# EAGLE design XOrduino-v1 (EAGLE 6.2)
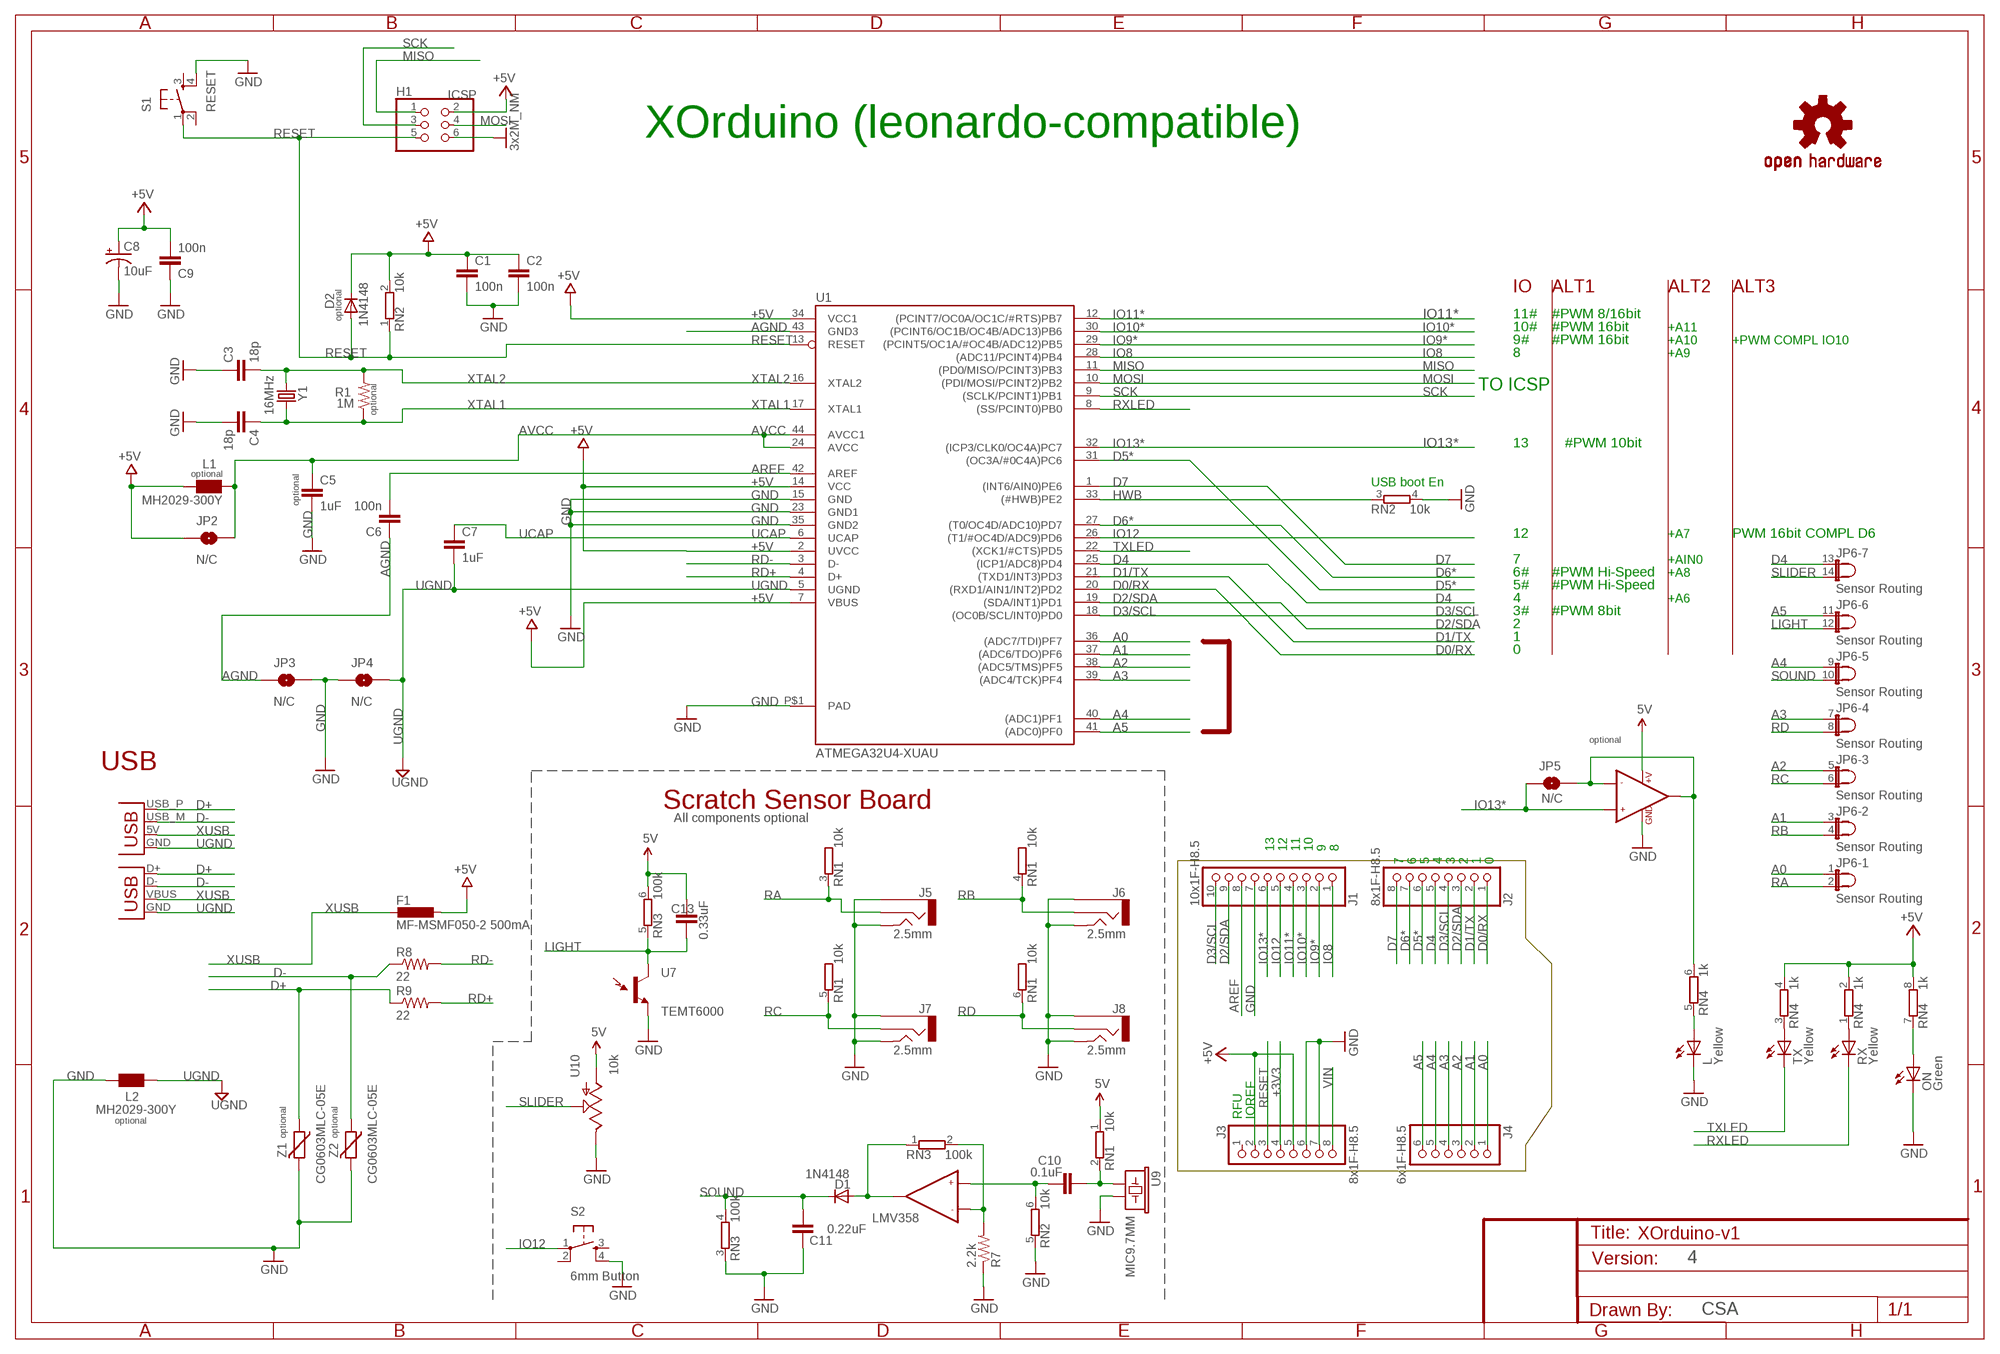
[diagram p0: schematic, sheet 1]

## Parts
C1  100n  CAPPTH  [CAP-PTH-SMALL]
C2  100n  CAPPTH  [CAP-PTH-SMALL]
C3  18p  CAPPTH  [CAP-PTH-SMALL]
C4  18p  CAPPTH  [CAP-PTH-SMALL]
C5  1uF  CAPPTH  [CAP-PTH-SMALL]
C6  100n  CAPPTH  [CAP-PTH-SMALL]
C7  1uF  CAPPTH  [CAP-PTH-SMALL]
C8  10uF  CAP_POLPTH2  [CPOL-RADIAL-10UF-25V]
C9  100n  CAPPTH  [CAP-PTH-SMALL]
C10  0.1uF  CAPPTH  [CAP-PTH-SMALL]
C11  0.22uF  CAPPTH  [CAP-PTH-SMALL]
C13  0.33uF  CAPPTH  [CAP-PTH-SMALL]
D1  1N4148  DIODE1N4148  [DIODE-1N4148]
D2  1N4148  DIODE1N4148  [DIODE-1N4148]
F1  MF-MSMF050-2 500mA  L-EUL1812  [L1812]
H1  ICSP  PINHD-2X3  [2X03]
J1  10x1F-H8.5  PINHD-1X10  [1X10]
J2  8x1F-H8.5  PINHD-1X8  [1X08]
J3  8x1F-H8.5  PINHD-1X8  [1X08]
J4  6x1F-H8.5  PINHD-1X6  [1X06]
J5  2.5mm  AUDIO-JACKSMD  [STEREOJACK2.5MM_SMD]
J6  2.5mm  AUDIO-JACKSMD  [STEREOJACK2.5MM_SMD]
J7  2.5mm  AUDIO-JACKSMD  [STEREOJACK2.5MM_SMD]
J8  2.5mm  AUDIO-JACKSMD  [STEREOJACK2.5MM_SMD]
JP2  N/C  SOLDERJUMPERTRACE  [SJ_2S-TRACE]
JP3  N/C  SOLDERJUMPERTRACE  [SJ_2S-TRACE]
JP4  N/C  SOLDERJUMPERTRACE  [SJ_2S-TRACE]
JP5  N/C  SOLDERJUMPERTRACE  [SJ_2S-TRACE]
JP6  Sensor Routing  JP7QES  [JP7QS]
L  Yellow  LED3MM  [LED3MM]
L1  MH2029-300Y  WE-CBF_0805  [0805]
L2  MH2029-300Y  WE-CBF_0805  [0805]
ON  Green  LED3MM  [LED3MM]
R1  1M  RESISTORAXIAL-0.3  [AXIAL-0.3]
R7  2.2k  RESISTORAXIAL-0.3  [AXIAL-0.3]
R8  22  RESISTORAXIAL-0.3  [AXIAL-0.3]
R9  22  RESISTORAXIAL-0.3  [AXIAL-0.3]
RN1  10k  GE05RP  [SIL6]
RN2  10k  E3RP  [SIL6]
RN3  100k  E3RP  [SIL6]
RN4  1k  E4RP  [SIL8]
RX  Yellow  LED3MM  [LED3MM]
S1  RESET  TAC_SWITCHPTH  [TACTILE-PTH]
S2  6mm Button  TAC_SWITCHPTH  [TACTILE-PTH]
TX  Yellow  LED3MM  [LED3MM]
U1  ATMEGA32U4-XUAU  [TQFP44-PAD]
U7  TEMT6000  [TEMT6000-SEN]
U8  LMV358  [SO08]
U9  MIC9.7MM  [MIC-9.7MM]
U10  10k  POT  [ALPS_POT]
U$5  OSHW-LOGOL  [OSHW-LOGO-L]
X1  USBPCB  [USB-A-PCB]
X2  USB  [USB-MB-H2]
Y1  16MHz  CRYSTALHC49US  [HC49US]
Z1  CG0603MLC-05E  VARISTORCN0603  [CT/CN0603]
Z2  CG0603MLC-05E  VARISTORCN0603  [CT/CN0603]

## Nets
5V: C13.1 RN1.1 RN3.6 U8.8(+V) U10.P$3(A)
+3V3: J3.4
+5V [power]: C1.1 C2.1 C8.1(+) C9.2 D2.C F1.1 H1.2 J3.2 J3.5 JP2.1 L1.1 RN2.2 RN4.2 RN4.4 RN4.8 U1.2(UVCC) U1.7(VBUS) U1.14(VCC) U1.34(VCC1)
A0: J4.1 JP6.1 U1.36((ADC7/TDI)PF7)
A1: J4.2 JP6.3 U1.37((ADC6/TDO)PF6)
A2: J4.3 JP6.5 U1.38((ADC5/TMS)PF5)
A3: J4.4 JP6.7 U1.39((ADC4/TCK)PF4)
A4: J4.5 JP6.9 U1.40((ADC1)PF1)
A5: J4.6 JP6.11 U1.41((ADC0)PF0)
AGND: C6.1 JP3.1 U1.43(GND3)
AREF [aref]: C6.2 J1.8 U1.42(AREF)
AVCC: C5.1 JP2.2 L1.2 U1.24(AVCC) U1.44(AVCC1)
D0/RX: J2.1 U1.20((RXD1/AIN1/INT2)PD2)
D1/TX: J2.2 U1.21((TXD1/INT3)PD3)
D2/SDA: J1.9 J2.3 U1.19((SDA/INT1)PD1)
D3/SCL: J1.10 J2.4 U1.18((OC0B/SCL/INT0)PD0)
D4: J2.5 JP6.13 U1.25((ICP1/ADC8)PD4)
D5*: J2.6 U1.31((OC3A/#0C4A)PC6)
D6*: J2.7 U1.27((T0/OC4D/ADC10)PD7)
D7: J2.8 U1.1((INT6/AIN0)PE6)
D+: R9.P$1 X1.USB_P(D+) X2.D+ Z1.1
D-: R8.P$1 X1.USB_M(D-) X2.D- Z2.1
GND [gnd]: C1.2 C2.2 C3.1 C4.2 C5.2 C8.2(-) C9.1 C11.1 H1.6 J1.7 J3.6 J3.7 J5.1 J5.5 J6.1 J6.5 J7.1 J7.5 J8.1 J8.5 JP3.2 JP4.1 L2.2 L.K(C) ON.K(C) R7.P$1 RN2.4 RN2.5 RN3.3 S1.4 S2.4 U1.15(GND) U1.23(GND1) U1.35(GND2) U1.P$1(PAD) U7.EMITTER(E1) U8.4(GND) U9.2 U10.P$1(E) Z1.2 Z2.2 ; supply symbol labelled 3x2M_NM
HWB: RN2.3 U1.33((#HWB)PE2)
IO8: J1.1 U1.28((ADC11/PCINT4)PB4)
IO9*: J1.2 U1.29((PCINT5/OC1A/#OC4B/ADC12)PB5)
IO10*: J1.3 U1.30((PCINT6/OC1B/OC4B/ADC13)PB6)
IO11*: J1.4 U1.12((PCINT7/OC0A/OC1C/#RTS)PB7)
IO12: J1.5 S2.1 U1.26((T1/#OC4D/ADC9)PD6)
IO13*: J1.6 JP5.1 U1.32((ICP3/CLK0/OC4A)PC7) U8.3(+IN1)
LIGHT: C13.2 JP6.12 RN3.5 U7.COLLECTOR(C1)
MISO: H1.1 U1.11((PD0/MISO/PCINT3)PB3)
MOSI: H1.4 U1.10((PDI/MOSI/PCINT2)PB2)
N$1: RN4.3 TX.A
N$2: L.A RN4.5
N$3: ON.A RN4.7
N$4: RN4.1 RX.A
N$5: R7.P$2 RN3.2 U8.6(-IN2)
N$6: JP5.2 RN4.6 U8.1(OUT1) U8.2(-IN1)
N$9: C10.1 RN1.2 U9.1
N$11: C10.2 RN2.6 U8.5(+IN2)
N$16: D1.A RN3.1 U8.7(OUT2)
RA: J5.4 JP6.2 RN1.3
RB: J6.4 JP6.4 RN1.4
RC: J7.4 JP6.6 RN1.5
RD: J8.4 JP6.8 RN1.6
RD+: R9.P$2 U1.4(D+)
RD-: R8.P$2 U1.3(D-)
RESET: D2.A H1.5 J3.3 RN2.1 S1.1 U1.13(RESET)
RXLED: RX.K(C) U1.8((SS/PCINT0)PB0)
SCK: H1.3 U1.9((SCLK/PCINT1)PB1)
SLIDER: JP6.14 U10.P$2(S)
SOUND: C11.2 D1.C JP6.10 RN3.4
TXLED: TX.K(C) U1.22((XCK1/#CTS)PD5)
UCAP: C7.1 U1.6(UCAP)
UGND [gnd]: C7.2 JP4.2 L2.1 U1.5(UGND) X1.GND X2.GND
VIN [power]: J3.8
XTAL1: C4.1 R1.P$1 U1.17(XTAL1) Y1.2
XTAL2: C3.2 R1.P$2 U1.16(XTAL2) Y1.1
XUSB [usbvcc]: F1.2 X1.5V(VBUS) X2.VBUS
Unconnected: J3.1 S1.2 S1.3 S2.2 S2.3

## Notes on the sheet
- XOrduino (leonardo-compatible)
- IO | ALT1 | ALT2 | ALT3
- optional | 11# | #PWM 8/16bit
- 10# | #PWM 16bit | +A11
- 9# | #PWM 16bit | +A10 | +PWM COMPL IO10
- 8 | +A9
- TO ICSP
- optional
- 13 | #PWM 10bit
- optional
- USB boot En
- optional
- 12 | +A7 | PWM 16bit COMPL D6
- 7 | +AIN0
- 6# | #PWM Hi-Speed | +A8
- 5# | #PWM Hi-Speed
- 4 | +A6
- 3# | #PWM 8bit
- 2
- 1
- 0
- optional
- USB
- Scratch Sensor Board
- All components optional
- 13 | 12 | 11 | 10 | 9 | 8
- 7 | 6 | 5 | 4 | 3 | 2 | 1 | 0
- RFU | IOREF
- optional
- optional | optional
- LMV358
- 4
- CSA

## Library data of the parts
C1-C7 C9-C11 C13 = SparkFun-Passives:CAP: Capacitor Standard 0603 ceramic capacitor, and 0.1" leaded capacitor.
C8 = SparkFun-Passives:CAP_POL: Capacitor Polarized These are standard SMD and PTH capacitors. Normally 10uF, 47uF, and 100uF in electrolytic and tantalum varieties. Always verify the external diameter of the through hole cap, it varies with capacity, voltage, and manufacturer. The EIA devices should be standard.
D1 D2 = SparkFun-DiscreteSemi:DIODE: Diode These are standard reverse protection diodes and small signal diodes. SMA package can handle up to about 1A. SOD-323 can handle about 200mA. What the SOD-323 package when ordering, there are some mfgs out there that are 5-pin packages.
F1 = rcl:L-EU: INDUCTOR, European symbol
H1 = SmartPrj:PINHD-2X3: PIN HEADER
J1 = SmartPrj:PINHD-1X10: PIN HEADER
J2 J3 = SmartPrj:PINHD-1X8: PIN HEADER
J4 = SmartPrj:PINHD-1X6: PIN HEADER
J5-J8 = SparkFun:AUDIO-JACK: 3.5mm Audio Jack Simple 3.5mm common PCB mount audio jack. SKU: PRT-08032
JP2-JP5 = SparkFun-Passives:SOLDERJUMPER: Solder Jumper Standard SMD solder jumper. Used to automate production. Two varients : Normally Open and Normally Closed are the same, but have different paste layers. NC will have a large amount of paste and should jumper during reflow.
JP6 = xorduino:JP7QES: 7x2 block of N/C jumpers
L ON RX TX = led:LED: LED OSRAM: - CHIPLED LG R971, LG N971, LY N971, LG Q971, LY Q971, LO R971, LY R971 LH N974, LH R974 LS Q976, LO Q976, LY Q976 LO Q996 - Hyper CHIPLED LW Q18S LB Q993, LB Q99A, LB R99A - SideLED LS A670, LO A670, LY A670, LG A670, LP A670 LB A673, LV A673, LT A673, LW A673 LH A674 LY A675 LS A676, LA A676, LO A676, LY A676, LW A676 LS A679, LY A679, LG A679 - Hyper Micro SIDELED® LS Y876, LA Y876, LO Y876, LY Y876 LT Y87S - SmartLED LW L88C, LW L88S LB L89C, LB L89S, LG L890 LS L89K, LO L89K, LY L89K LS L896, LA L896, LO L896, LY L896 - TOPLED LS T670, LO T670, LY T670, LG T670, LP T670 LSG T670, LSP T670, LSY T670, LOP T670, LYG T670 LG T671, LOG T671, LSG T671 LB T673, LV T673, LT T673, LW T673 LH T674 LS T676, LA T676, LO T676, LY T676, LB T676, LH T676, LSB T676, LW T676 LB T67C, LV T67C, LT T67C, LS T67K, LO T67K, LY T67K, LW E67C LS E67B, LA E67B, LO E67B, LY E67B, LB E67C, LV E67C, LT E67C LW T67C LS T679, LY T679, LG T679 LS T770, LO T770, LY T770, LG T770, LP T770 LB T773, LV T773, LT T773, LW T773 LH T774 LS E675, LA E675, LY E675, LS T675 LS T776, LA T776, LO T776, LY T776, LB T776 LHGB T686 LT T68C, LB T68C - Hyper Mini TOPLED® LB M676 - Mini TOPLED Santana® LG M470 LS M47K, LO M47K, LY M47K Source: http://www.osram.convergy.de LUXEON: - LUMILED® LXK2-PW12-R00, LXK2-PW12-S00, LXK2-PW14-U00, LXK2-PW14-V00 LXK2-PM12-R00, LXK2-PM12-S00, LXK2-PM14-U00 LXK2-PE12-Q00, LXK2-PE12-R00, LXK2-PE12-S00, LXK2-PE14-T00, LXK2-PE14-U00 LXK2-PB12-K00, LXK2-PB12-L00, LXK2-PB12-M00, LXK2-PB14-N00, LXK2-PB14-P00, LXK2-PB14-Q00 LXK2-PR12-L00, LXK2-PR12-M00, LXK2-PR14-Q00, LXK2-PR14-R00 LXK2-PD12-Q00, LXK2-PD12-R00, LXK2-PD12-S00 LXK2-PH12-R00, LXK2-PH12-S00 LXK2-PL12-P00, LXK2-PL12-Q00, LXK2-PL12-R00 Source: www.luxeon.com KINGBRIGHT: KA-3528ASYC Source: www.kingbright.com
L1 L2 = wuerth-elektronik:WE-CBF: SMD EMI Suppression Ferrite Beads - excellent anti-EMI properties - low DCR - impedances till 3000 ohms - rated current up to 6 A
R1 R7-R9 = SparkFun-Passives:RESISTOR: Resistor Basic schematic elements and footprints for 0603, 1206, and PTH resistors.
RN1 = resistor-sil:GE05RP: SIL RESISTOR; OC_FARNELL: unknown; OC_NEWARK: unknown
RN2 RN3 = resistor-sil:E3RP: SIL RESISTOR; OC_FARNELL: unknown; OC_NEWARK: unknown
RN4 = resistor-sil:E4RP: SIL RESISTOR; OC_FARNELL: unknown; OC_NEWARK: unknown
S1 S2 = SparkFun-Electromechanical:TAC_SWITCH: Momentary Switch Button commonly used for reset or general input. Spark Fun Electronics SKU : COM-00097
U1 = SmartPrj:ATMEGA32U4-XU
U7 = SparkFun:TEMT6000: Ambient Light Sensor Simple light detection sensor. Output varies with light intensity input. Spark Fun Electronics SKU : COM-08348
U8 = SparkFun:LMV358
U9 = SparkFun:MIC: Microphone Omni-directional electret microphone. 9.7mm standard diameter.
U10 = SparkFun-Electromechanical:POT
U$5 = SparkFun-Aesthetics:OSHW-LOGO: Open Source Hardware Logo This logo indicates the piece of hardware it is found on incorporates a OSHW license and/or adheres to the definition of open source hardware found here: http://freedomdefined.org/OSHW
X1 = SparkFun-Connectors:USB: USB Connectors USB-B-PTH is fully proven SKU : PRT-00139 USB-miniB is fully proven SKU : PRT-00587 USB-A-PCB is untested. USB-A-H is throughly reviewed, but untested. Spark Fun Electronics SKU : PRT-00437 USB-B-SMT is throughly reviewed, but untested. Needs silkscreen touching up. USB-A-S has not been used/tested USB-MB-H has not been used/tested
X2 = xorduino:USB
Y1 = SparkFun-FreqCtrl:CRYSTAL: Various standard crystals. Proven footprints. Spark Fun Electronics SKU : COM-00534
Z1 Z2 = varistor:VARISTOR: VARISTOR

## Net classes
0 default: width 0.254 mm, drill 0.61 mm, clearance 0.254 mm
1 power: width 0.254 mm, drill 0.61 mm, clearance 0.254 mm
2 gnd: width 0.254 mm, drill 0.61 mm, clearance 0.254 mm
3 usbvcc: width 0.254 mm, drill 0.61 mm, clearance 0.254 mm
4 aref: width 0.254 mm, drill 0.61 mm, clearance 0.254 mm

## Board
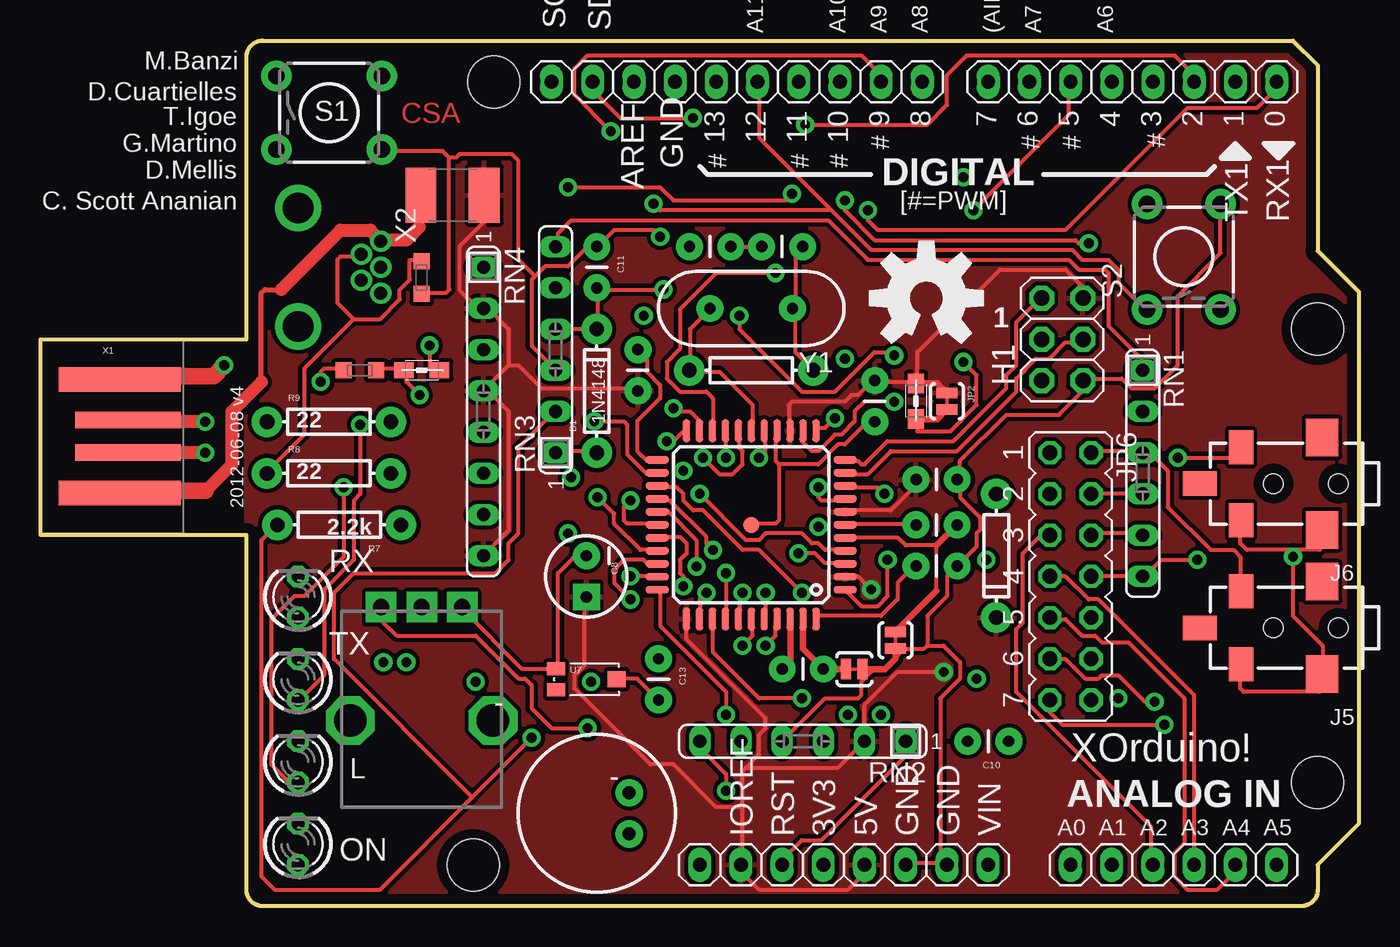
[diagram p1: board, top side]
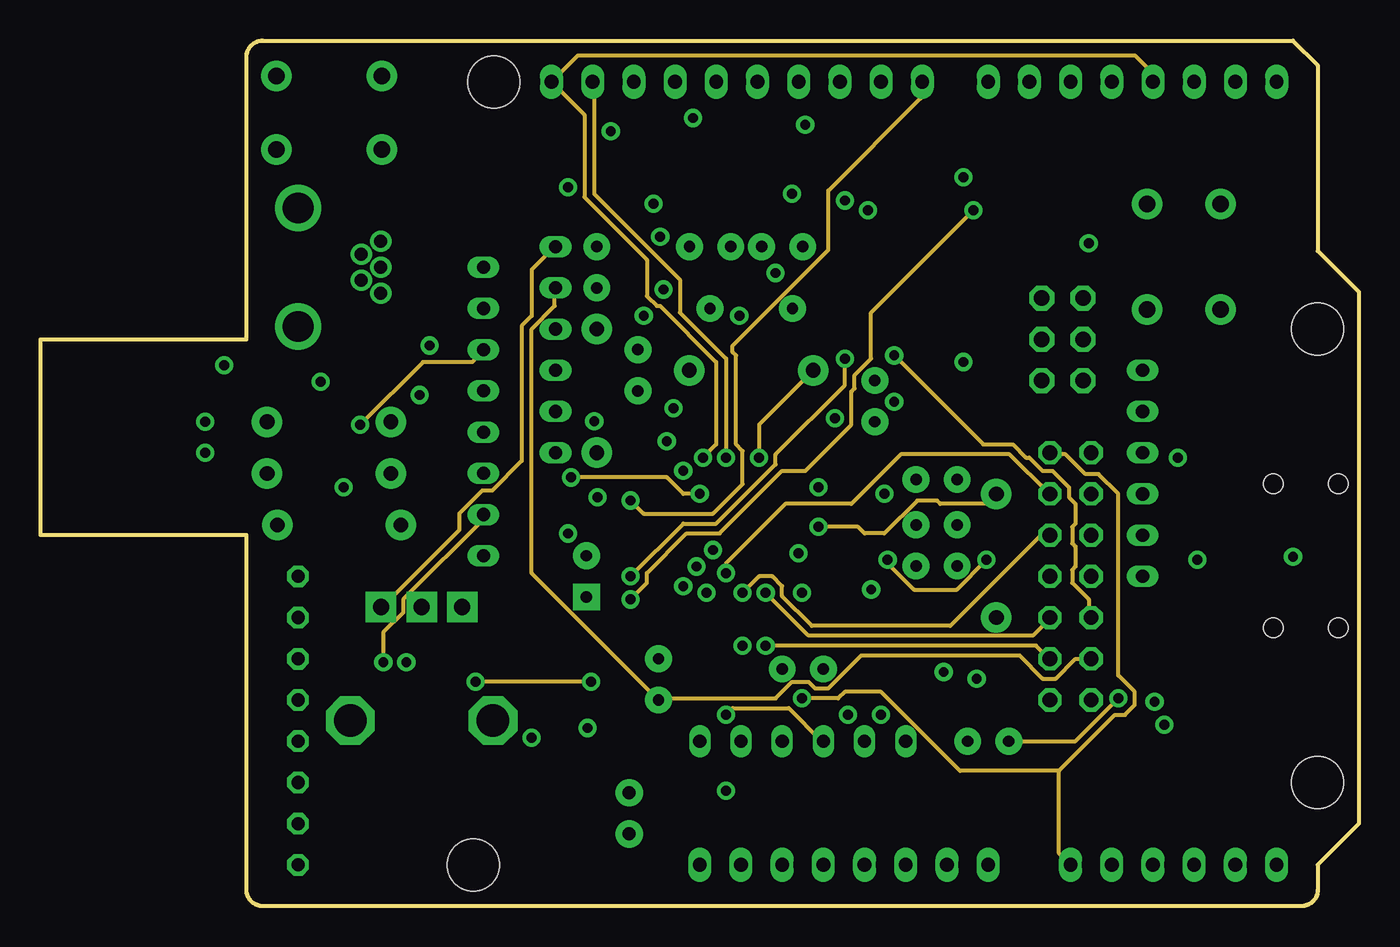
[diagram p2: board, inner layer Route2]
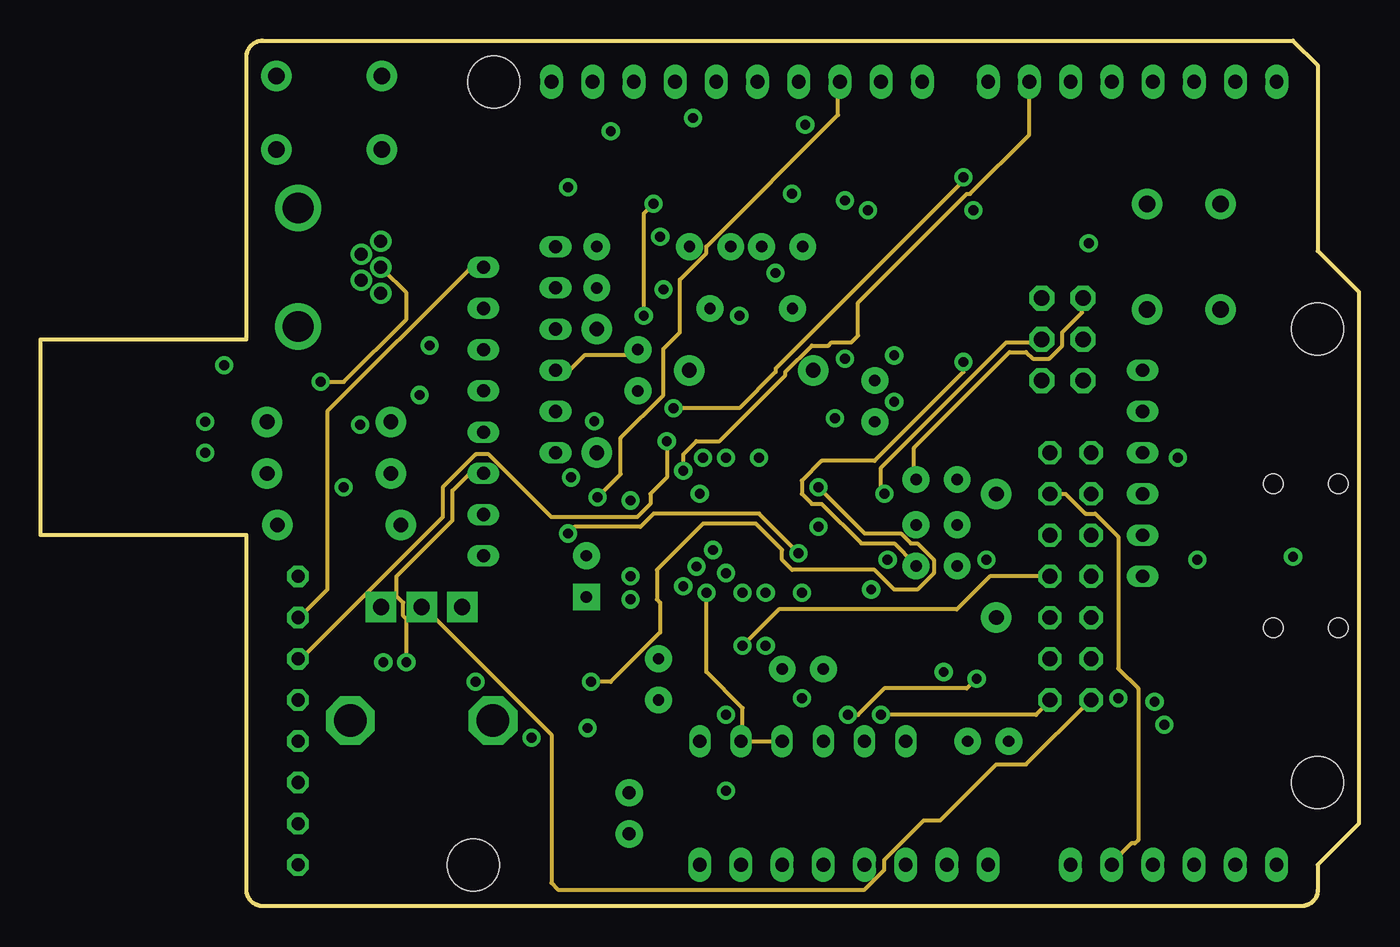
[diagram p3: board, inner layer Route15]
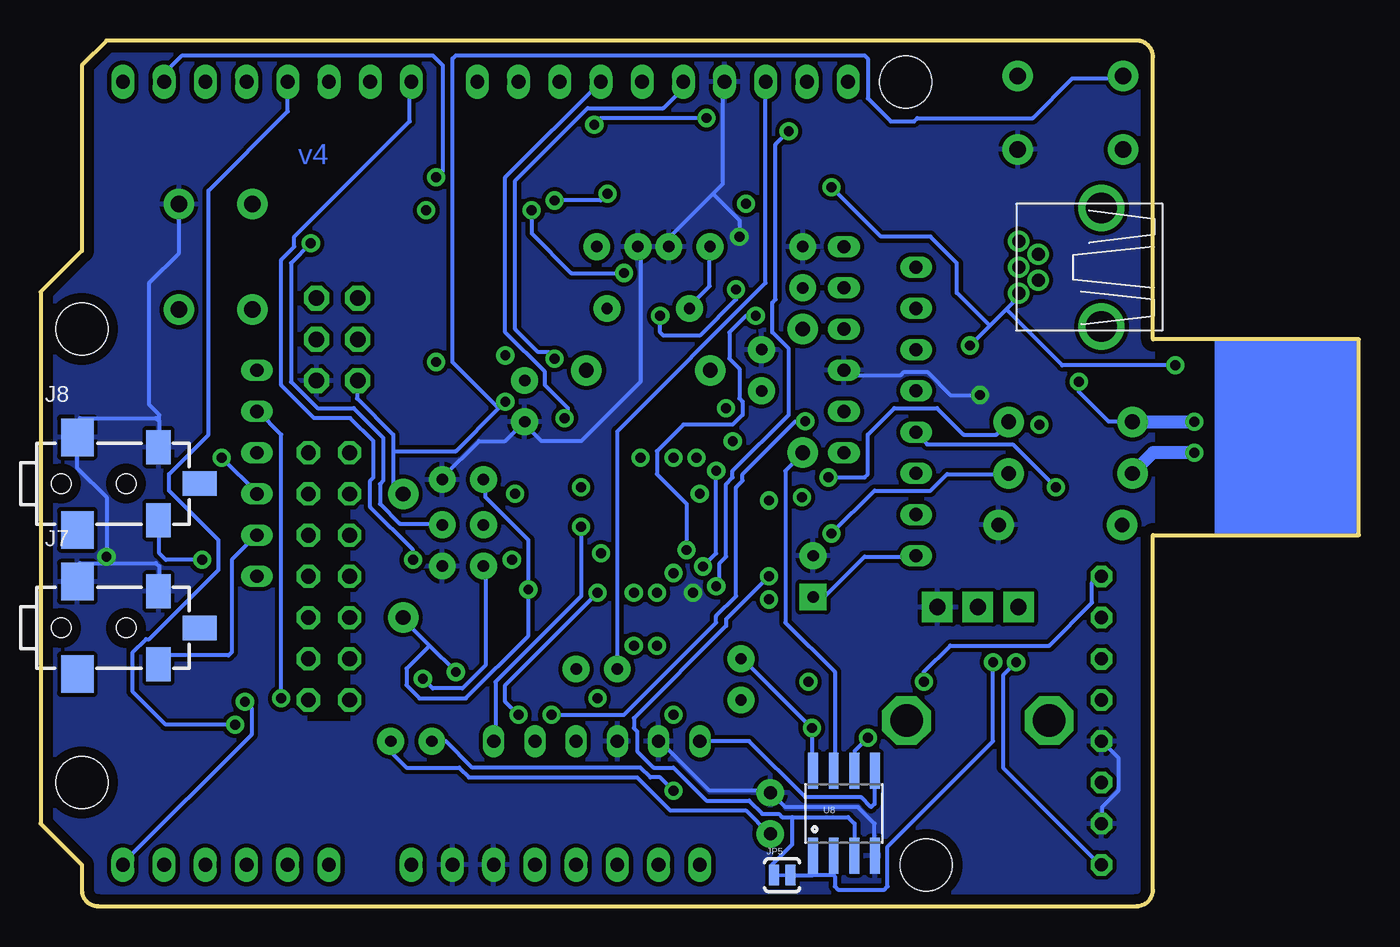
[diagram p4: board, bottom side, seen from below]

Size 81.28 x 53.34 mm. Coordinates in mm from the lower left corner, seen from the top.
Outline: 77.22,53.34 78.74,51.82 78.74,40.39 81.28,37.85 81.28,5.08 78.74,2.54 78.74,1 arc-90 77.74,0 13.7,0 arc-90 12.7,1 12.7,22.86 0,22.86 0,34.92 12.7,34.92 12.7,52.34 arc-90 13.7,53.34 77.22,53.34
Copper layers (1*2+15*16): Top 0.035mm / dielectric 0.2mm / Route2 0.035mm / dielectric 0.26mm / Route15 0.035mm / dielectric 0.2mm / Bottom 0.035mm
Design rules: minimum track width 8mil, minimum drill 22mil, track to track 8mil, track to pad 8mil, pad to pad 8mil, via to via 12mil, smd to smd 8mil, copper to edge 24mil, drill to drill 12mil, minimum pad ring 10mil, minimum via ring 10mil, stop-mask expansion 2mil, vias tented up to drill 30mil, thermal gap 10mil
Holes 3.2 mm at 78.74,35.56 78.74,7.62 27.94,50.8 26.67,2.54
vRestrict: area 42.5,38.6 to 43.1,38.9; area 35.8,35.2 to 36.4,35.7; area 44.5,35.2 to 45.2,35.7; area 41.3,35.2 to 41.8,35.7; area 47.9,10.3 to 48.5,10.8; area 50.4,10.2 to 50.9,11

### Footprints (pad centres in the part's own frame; a part is rotated, then mirrored left to right if it is on the bottom)
CAP-PTH-SMALL = drill 0.7 pad 1.651: 1 0,0; 2 2.54,0
CPOL-RADIAL-10UF-25V = drill 0.7 pad 1.651 square: 1 1.27,0 | drill 0.7 pad 1.651: 2 -1.27,0
DIODE-1N4148 = drill 0.9 pad 1.88: A -3.81,0; C 3.81,0
L1812 = smd 1.9 x 3.4: 1 -1.95,0; 2 1.95,0
2X03 = drill 0.95 pad 1.55 octagon: 1 -2.54,-1.27; 2 -2.54,1.27; 3 0,-1.27; 4 0,1.27; 5 2.54,-1.27; 6 2.54,1.27
1X10 = drill 0.85 pad 1.422 long: 1 -11.43,0; 2 -8.89,0; 3 -6.35,0; 4 -3.81,0; 5 -1.27,0; 6 1.27,0; 7 3.81,0; 8 6.35,0; 9 8.89,0; 10 11.43,0
1X08 = drill 0.85 pad 1.422 long: 1 -8.89,0; 2 -6.35,0; 3 -3.81,0; 4 -1.27,0; 5 1.27,0; 6 3.81,0; 7 6.35,0; 8 8.89,0
1X06 = drill 0.85 pad 1.422 long: 1 -6.35,0; 2 -3.81,0; 3 -1.27,0; 4 1.27,0; 5 3.81,0; 6 6.35,0
STEREOJACK2.5MM_SMD = smd 1.5 x 2.1: 1 6,2.25; 4 6,-2.25 | smd 2.1 x 1.5: 3 8.55,0 | smd 2 x 2.3: 5 1,2.85; A 1,-2.85 | hole 1.2: 0,0; 4,0
SJ_2S-TRACE = smd 0.635 x 1.27: 1 -0.508,0; 2 0.508,0
JP7QS = drill 0.914 octagon: 1 -7.62,-1.27; 2 -7.62,1.27; 3 -5.08,-1.27; 4 -5.08,1.27; 5 -2.54,-1.27; 6 -2.54,1.27; 7 0,-1.27; 8 0,1.27; 9 2.54,-1.27; 10 2.54,1.27; 11 5.08,-1.27; 12 5.08,1.27; 13 7.62,-1.27; 14 7.62,1.27
LED3MM = drill 0.813 octagon: A -1.27,0; K 1.27,0
0805 = smd 1.2 x 1: 1 -1.1,0; 2 1.1,0
AXIAL-0.3 = drill 0.9 pad 1.88: P$1 -3.81,0; P$2 3.81,0
SIL6 = drill 0.813 long: 1 -6.35,0; 2 -3.81,0; 3 -1.27,0; 4 1.27,0; 5 3.81,0; 6 6.35,0
SIL8 = drill 0.813 long: 1 -8.89,0; 2 -6.35,0; 3 -3.81,0; 4 -1.27,0; 5 1.27,0; 6 3.81,0; 7 6.35,0; 8 8.89,0
TACTILE-PTH = drill 1.016 pad 1.88: 1 -3.251,2.261; 2 3.251,2.261; 3 -3.251,-2.261; 4 3.251,-2.261
TQFP44-PAD = smd 1.4 x 0.45: 1 -5.8,4; 2 -5.8,3.2; 3 -5.8,2.4; 4 -5.8,1.6; 5 -5.8,0.8; 6 -5.8,0; 7 -5.8,-0.8; 8 -5.8,-1.6; 9 -5.8,-2.4; 10 -5.8,-3.2; 11 -5.8,-4; 23 5.8,-4; 24 5.8,-3.2; 25 5.8,-2.4; 26 5.8,-1.6; 27 5.8,-0.8; 28 5.8,0; 29 5.8,0.8; 30 5.8,1.6; 31 5.8,2.4; 32 5.8,3.2; 33 5.8,4 | smd 0.45 x 1.4: 12 -4,-5.8; 13 -3.2,-5.8; 14 -2.4,-5.8; 15 -1.6,-5.8; 16 -0.8,-5.8; 17 0,-5.8; 18 0.8,-5.8; 19 1.6,-5.8; 20 2.4,-5.8; 21 3.2,-5.8; 22 4,-5.8; 34 4,5.8; 35 3.2,5.8; 36 2.4,5.8; 37 1.6,5.8; 38 0.8,5.8; 39 0,5.8; 40 -0.8,5.8; 41 -1.6,5.8; 42 -2.4,5.8; 43 -3.2,5.8; 44 -4,5.8 | smd 1 x 1: P$1 0,0
TEMT6000-SEN = smd 1.1 x 0.8: BASE -1.87,-0.65; EMITTER -1.87,0.65 | smd 1.1 x 1: COLLECTOR 1.86,0.01
SO08 = smd 0.61 x 2.21: 1 -1.905,-2.616; 2 -0.635,-2.616; 3 0.635,-2.616; 4 1.905,-2.616; 5 1.905,2.616; 6 0.635,2.616; 7 -0.635,2.616; 8 -1.905,2.616
MIC-9.7MM = drill 0.8 pad 1.676: 1 -2,1.27; 2 -2,-1.27
ALPS_POT = drill 1 pad 1.88 square: P$1 7,-2.5; P$2 7,0; P$3 7,2.5 | drill 2 octagon: P$4 0,-4.4; P$5 0,4.4
USB-A-PCB = smd 7.5 x 1.5: 5V -0.2,-3.5; GND -0.2,3.5 | smd 6.5 x 1: USB_M 0.3,-1; USB_P 0.3,1
USB-MB-H2 = drill 0.8 pad 1.219: D+ 5.1,0; D- 3.9,0.8; GND 5.1,-1.6; ID 3.9,-0.8; VBUS 5.1,1.6 | drill 1.9 pad 2.667: P$6 0,-3.65; P$7 0,3.65
HC49US = drill 0.7 pad 1.651: 1 -2.54,0; 2 2.54,0
CT/CN0603 = smd 1 x 1: 1 -1,0; 2 1,0

### Placement (x,y rotation side)
C1  36.83,31.75 90 top
C2  51.44,32.38 270 top
C3  44.45,40.64 0 top
C4  40.01,40.64 0 top
C5  53.98,20.95 0 top
C6  48.26,14.61 180 top
C7  53.98,23.5 0 top
C8  33.66,20.32 270 top
C9  56.52,26.29 180 top
C10  59.69,10.16 180 top
C11  34.29,40.64 270 top
C13  38.1,15.24 270 top
D1  34.29,31.75 90 top
D2  58.93,21.59 270 top
F1  25.4,43.81 180 top
H1  62.99,34.92 270 top
J1  42.93,50.8 180 top
J2  67.31,50.8 180 top
J3  49.53,2.54 0 top
J4  69.85,2.54 0 top
J5  80.01,17.14 180 top
J6  80.01,26.04 180 top
J7  80.01,17.14 0 bottom
J8  80.01,26.04 0 bottom
JP2  55.88,31.11 270 top
JP3  50.16,14.61 0 top
JP4  52.7,16.38 90 top
JP5  35.56,1.91 0 bottom
JP6  63.5,20.32 270 top
L  15.88,8.89 90 top
L1  53.98,31.11 270 top
L2  23.5,33.02 180 top
ON  15.88,3.81 90 top
R1  43.81,33.02 0 top
R7  18.41,23.5 180 top
R8  17.78,26.67 0 top
R9  17.78,29.84 0 top
RN1  67.94,26.67 270 top
RN2  46.99,10.16 180 top
RN3  31.75,34.29 90 top
RN4  27.3,30.48 270 top
RX  15.88,19.05 90 top
S1  17.78,48.9 0 top
S2  70.48,40.01 90 top
TX  15.88,13.97 90 top
U1  43.81,23.5 180 top
U7  33.66,13.97 0 top
U8  31.75,5.71 0 bottom
U9  34.29,5.71 180 top
U10  23.5,11.43 90 top
U$5  54.61,37.47 0 top
X1  5.08,28.96 0 top
X2  15.88,39.37 0 top
Y1  43.81,36.83 180 top
Z1  19.68,33.02 0 top
Z2  23.5,38.73 270 top

### Tracks (layer width: path | path; a pad name or v marks a point on that pad's centre or on a via)
5V  (via drill 0.61)
  Top 0.254: RN1.1 67.87,33.12 67.87,33.73 65.84,35.76 65.84,39.01 65.63,39.22 64.01,39.22 63.4,39.83 51,39.83 48.56,42.27 32.72,42.27 31.9,41.45 31.9,40.64 RN3.6 | v33.73,10.97 31.5,10.97 30.28,12.19 30.28,13.61 29.87,14.02 29.46,14.02 26.82,16.66 21.95,16.66 21.13,17.48 21.13,18.29 U10.P$3
  Route2 0.254: U10.P$3 21.13,18.49 25.81,23.16 25.81,24.18 27.23,25.6 27.84,25.6 29.67,27.43 29.67,35.76 30.28,36.37 30.28,39.22 31.7,40.64 RN3.6
  Bottom 0.254: U8.8 33.73,8.33 v33.73,10.97 38,15.24 C13.1
+5V  (via drill 0.61)
  Top 0.254: F1.1 27.43,43.69 27.43,42.27 25.81,40.64 25.81,38 26.82,36.98 27.23,36.98 RN4.2 27.43,36.98 28.85,35.56 28.85,33.33 | 28.85,33.33 27.43,31.9 | 28.85,33.33 29.46,33.33 30.89,31.9 36.78,31.9 C1.1 | 27.43,31.9 28.85,30.48 28.85,23.16 27.43,21.74 RN4.8 | 27.43,31.9 RN4.4 | U1.14 46.13,29.46 46.13,30.89 46.33,31.09 49.58,31.09 49.99,31.5 50.39,31.5 51.41,32.51 C2.1 51.61,32.31 53.85,32.31 L1.1 54.05,32.31 54.05,34.14 59.13,39.22 63.2,39.22 64.21,38.2 64.21,37.59 H1.2 | 43.48,8.53 43.28,8.33 43.28,6.1 | 43.48,8.53 44.3,9.35 44.3,10.57 44.7,10.97 44.7,11.58 39.83,16.46 39.83,17.68 U1.34 | 43.28,6.1 43.28,2.64 J3.2 43.28,2.44 43.28,2.03 44.3,1.02 49.78,1.02 50.8,2.03 J3.5 | 43.48,8.53 49.17,8.53 RN2.2 50.8,12.39 52.83,14.43 v55.68,14.43 | 43.28,6.1 41.66,6.1 39.01,8.74 37.59,8.74 32.92,13.41 32.92,14.22 33.53,14.83 33.53,18.9 C8.1 | v51.21,19.51 50.39,20.32 49.78,20.32 U1.2 | U1.7 49.78,24.38 52.43,24.38 53.85,25.81 53.85,26.21 C9.2
  Top 0.406: L1.1 55.29,32.22 JP2.1
  Route15 0.254: H1.2 64.21,37.39 64.21,36.58 62.99,35.36 62.99,34.54 62.18,33.73 61.16,33.73 60.76,34.14 59.74,34.14 53.85,28.25 53.85,26.42 C9.2
  Bottom 0.254: RN4.8 27.43,21.54 30.48,21.54 32.92,19.1 33.53,19.1 C8.1 | v55.68,14.43 57.3,16.05 | 57.3,16.05 58.93,17.68 D2.C | 57.3,16.05 58.73,14.63 58.73,13.61 57.91,12.8 55.07,12.8 51.21,16.66 v51.21,19.51 51.21,22.55 53.85,25.2 53.85,26.21 C9.2
  pour Top (isolate 0.001): 12.7,1.27 12.7,52.07 13.97,53.34 77.47,53.34 78.74,52.07 78.74,40.64 81.28,38.1 81.28,5.08 78.74,2.54 78.74,1.27 77.47,0 13.97,0
A0  (via drill 0.61)
  Top 0.254: v46.94,12.8 44.3,12.8 41.45,15.65 41.45,17.68 U1.36
  Route2 0.254: 62.79,8.33 66.24,11.79 66.85,11.79 67.46,12.39 67.46,13.21 66.45,14.22 66.45,25.4 65.23,26.62 64.41,26.62 63.2,27.84 62.38,27.84 JP6.1 | 62.79,8.33 62.79,3.25 J4.1 | v46.94,12.8 49.17,12.8 49.58,13.21 51.82,13.21 56.69,8.33 62.79,8.33
A1  (via drill 0.61)
  Top 0.254: v42.27,20.52 42.27,17.88 U1.37
  Route2 0.254: v42.27,20.52 42.27,21.13 45.92,24.79 49.99,24.79 53.03,27.84 59.74,27.84 62.18,25.4 JP6.3
  Route15 0.254: JP6.3 63.2,25.4 64.41,24.18 65.02,24.18 66.45,22.76 66.45,14.63 67.67,13.41 67.67,4.06 67.46,3.86 67.26,3.86 66.04,2.64 J4.2
A2  (via drill 0.61)
  Top 0.254: JP6.5 62.18,22.76 61.57,22.76 60.55,21.74 60.55,17.48 60.15,17.07 60.15,13.21 68.48,4.88 68.48,2.64 J4.3 | v43.28,19.3 43.08,19.1 43.08,17.88 U1.38
  Route2 0.254: v43.28,19.3 44.3,20.32 45.11,20.32 45.72,19.71 45.72,19.1 47.55,17.27 56.08,17.27 61.57,22.76 62.18,22.76 JP6.5
A3  (via drill 0.61)
  Top 0.254: JP6.7 63.2,20.32 64.62,18.9 65.23,18.9 71.12,13.01 J4.4 | v43.28,16.05 43.89,16.66 43.89,17.68 U1.39
  Route15 0.254: v43.28,16.05 45.52,18.29 56.49,18.29 58.52,20.32 JP6.7
A4  (via drill 0.61)
  Top 0.254: v44.7,19.3 44.7,17.88 U1.40 | J4.5 73.56,2.44 73.56,2.03 72.54,1.02 70.71,1.02 69.9,1.83 69.9,3.25 70.51,3.86 70.51,12.8 67.06,16.26 65.43,16.26 65.02,16.66 64.21,16.66 63.2,17.68 62.38,17.68 JP6.9
  Route2 0.254: v44.7,19.3 47.35,16.66 61.16,16.66 62.18,17.68 JP6.9
A5  (via drill 0.61)
  Top 0.254: v44.7,16.05 45.31,16.66 45.31,17.68 U1.41 | v68.68,12.6 68.07,12.6 66.45,14.22 65.43,14.22 65.23,14.02 64.41,14.02 63.2,15.24 JP6.11
  Route2 0.254: v44.7,16.05 61.37,16.05 62.18,15.24 JP6.11
  Bottom 0.254: v68.68,12.6 68.28,12.19 68.28,10.57 76.2,2.64 J4.6
AGND
  Top 0.406: JP3.1 C6.1 47.02,15.85 U1.43
AREF
  Top 0.406: U1.42 46.23,17.68 46.23,14.61 C6.2
  Bottom 0.254: J1.8 36.58,38.41 45.72,29.26 C6.2
AVCC  (via drill 0.61)
  Top 0.254: v56.9,33.53 57.71,32.72 57.71,30.89 56.08,29.26 54.05,29.26 54.05,29.87 L1.2 | v34.14,29.87 35.97,29.87 36.17,29.67 36.17,27.84 37.39,26.62 38,26.62 U1.24 | U1.44 47.95,17.88 51.82,17.88 52.83,18.9 52.83,19.91 53.85,20.93 C5.1
  Top 0.406: L1.2 55.29,30.02 JP2.2
  Route15 0.254: v56.9,33.53 56.9,32.92 51.41,27.43 48.16,27.43 46.94,26.21 46.94,25.4 47.55,24.79 48.16,24.79 50.6,22.35 52.63,22.35 53.85,21.13 C5.1 | v49.78,11.79 50.39,11.79 52.02,13.41 57.1,13.41 v57.71,14.02
  Bottom 0.254: v34.14,29.87 34.75,29.87 38,26.62 38,26.21 38.41,25.81 38.41,19.1 39.62,17.88 39.62,17.48 45.31,11.79 v49.78,11.79 | v57.71,14.02 57.1,13.41 55.27,13.41 53.85,14.83 53.85,20.93 C5.1
D0/RX  (via drill 0.61)
  Top 0.254: v45.31,39.01 41.66,39.01 39.42,36.78 39.42,34.34 38.61,33.53 38.61,32.51 39.42,31.7 41.05,31.7 41.45,31.29 41.45,29.46 U1.20 | v51,42.88 51,42.27 51.61,41.66 63.2,41.66 70.71,49.17 74.98,49.17 76.2,50.39 J2.1
  Bottom 0.254: v45.31,39.01 48.56,39.01 51,41.45 v51,42.88
D1/TX  (via drill 0.61)
  Top 0.254: v39.01,30.68 39.22,30.48 40.03,30.48 40.64,29.87 40.64,29.46 U1.21
  Route15 0.254: v39.01,30.68 43.08,30.68 45.31,32.92 45.31,33.12 56.9,44.7 v56.9,44.91
  Bottom 0.254: v56.9,44.91 56.49,45.31 56.49,51.82 57.1,52.43 72.54,52.43 73.56,51.41 73.56,50.8 J2.2
D2/SDA  (via drill 0.61)
  Top 0.254: v42.27,27.64 42.27,29.26 U1.19 | J2.3 71.12,51.21 69.9,52.43 57.1,52.43 55.88,51.21 55.88,49.38 54.66,48.16 v47.14,48.16 | v40.23,48.56 35.76,48.56 34.14,50.19 34.14,50.8 J1.9
  Route2 0.254: v42.27,27.64 42.27,33.73 39.42,36.58 39.42,38.61 34.14,43.89 34.14,50.8 J1.9
  Bottom 0.254: v47.14,48.16 46.74,48.56 v40.23,48.56
D3/SCL  (via drill 0.61)
  Top 0.254: v40.84,27.64 41.86,26.62 42.67,26.62 43.28,27.23 43.28,28.04 43.08,28.25 43.08,29.26 U1.18
  Route2 0.254: v40.84,27.64 41.66,28.45 41.66,33.53 38.2,36.98 38,36.98 37.39,37.59 37.39,39.83 33.53,43.69 33.53,48.77 J1.10 33.12,52.43 67.46,52.43 68.48,51.41 68.48,50.8 J2.4
D4  (via drill 0.61)
  Top 0.254: v69.29,11.18 62.99,11.18 62.18,11.99 62.18,12.6 JP6.13 | v46.94,19.3 44.3,21.95 43.28,21.95 40.84,24.38 40.23,24.38 39.62,24.99 39.62,25.4 39.22,25.81 38.2,25.81 U1.25
  Route15 0.254: v51.82,11.79 61.37,11.79 62.18,12.6 JP6.13
  Bottom 0.254: J2.5 66.04,48.97 70.92,44.09 70.92,29.06 73.36,26.62 73.36,25.6 70.31,22.55 70.31,20.73 74.57,16.46 74.78,16.46 75.59,15.65 75.59,13.21 73.56,11.18 v69.29,11.18 | v46.94,19.3 52.63,13.61 52.63,12.6 v51.82,11.79
D5*  (via drill 0.61)
  Top 0.254: v57.51,42.88 63.4,48.77 63.4,50.8 J2.6 | v36.37,18.9 35.36,19.91 35.36,20.73 35.97,21.34 37.19,21.34 37.39,21.13 38,21.13 U1.31
  Route2 0.254: v57.51,42.88 51.21,36.58 51.21,33.73 50.19,32.72 50.19,31.9 49.99,31.7 49.99,29.67 47.14,26.82 45.72,26.82 41.86,22.96 39.83,22.96 37.39,20.52 37.39,19.91 v36.37,18.9
D6*  (via drill 0.61)
  Top 0.254: v40.44,20.93 40.44,22.55 38.61,24.38 38.2,24.38 U1.27
  Route15 0.254: J2.7 60.96,47.55 57.3,43.89 57.1,43.89 50.39,37.19 50.39,35.15 49.99,34.75 48.77,34.75 48.56,34.54 47.55,34.54 45.92,32.92 45.92,32.72 41.86,28.65 40.44,28.65 39.62,27.84 v39.62,26.82
  Bottom 0.254: v39.62,26.82 39.62,21.74 v40.44,20.93
D7  (via drill 0.61)
  Top 0.254: v52.22,21.34 52.22,19.1 51.61,18.49 50.6,18.49 49.78,19.3 U1.1
  Route2 0.254: v58.32,21.34 56.49,19.51 53.85,19.51 52.22,21.13 v52.22,21.34
  Bottom 0.254: v58.32,21.34 58.32,21.95 60.96,24.59 60.96,26.21 60.76,26.42 60.76,28.65 62.18,30.07 64.41,30.07 66.45,32.11 66.45,39.83 65.63,40.64 65.63,41.25 58.52,48.36 58.52,50.8 J2.8
D+  (via drill 0.61)
  Top 0.254: v17.27,32.31 17.27,32.92 17.48,33.12 18.49,33.12 Z1.1 | 5.49,29.84 X1.USB_P
  Top 0.813: v10.16,29.84 5.49,29.84
  Route15 0.254: v17.27,32.31 18.69,32.31 22.55,36.17 22.55,37.8 21.13,39.22 X2.D+
  Bottom 0.254: v17.27,32.31 17.27,31.7 15.44,29.87 14.02,29.87 R9.P$1
  Bottom 0.813: R9.P$1 v10.16,29.84
D-  (via drill 0.61)
  Top 0.254: 19.3,36.17 20.93,36.17 22.15,37.39 22.15,38 22.76,38.61 22.76,39.83 23.37,39.83 Z2.1 | 19.3,36.17 18.29,37.19 18.29,39.83 18.49,40.03 19.71,40.03 X2.D- | 19.3,36.17 16.26,33.12 16.26,29.06 14.02,26.82 R8.P$1 | 10.16,27.96 v10.16,27.94
  Top 0.813: X1.USB_M 10.16,27.96
  Bottom 0.813: v10.16,27.94 12.7,27.94 R8.P$1
GND  (via drill 0.61)
  Top 0.254: 55.47,2.64 55.88,2.64 J3.7 55.47,2.64 | 55.47,2.64 53.44,2.64 J3.6 | RN2.4 48.36,12.8 50.39,12.8 50.6,13.01 50.6,13.82 51.21,14.43 51.21,14.61 | 55.47,2.64 55.47,12.8 56.69,14.02 56.69,15.04 55.68,16.05 54.66,16.05 | 54.66,16.05 54.46,15.85 53.24,15.85 52.83,15.44 52.7,15.44 | v41.05,19.3 40.64,18.9 40.64,17.88 U1.35 | U10.P$1 26.01,18.29 29.67,14.63 31.7,14.63 U7.EMITTER 31.9,14.43 32.11,14.63 31.9,14.83 31.9,20.52 32.92,21.54 33.53,21.54 C8.2 | Z1.2 20.73,33.12 22.35,33.12 L2.2 22.55,32.92 22.55,32.31 v23.37,31.5 | 25.2,46.13 24.79,46.53 21.13,46.53 S1.4 | 25.2,46.13 25.2,38 24.99,37.8 23.57,37.8 Z2.2 | J5.1 73.97,14.83 73.97,13.41 74.17,13.21 78.84,13.21 79.05,13.41 79.05,14.22 J5.5 79.05,14.43 79.05,16.05 77.22,17.88 v77.22,21.54 77.22,21.95 | 77.22,21.95 78.84,21.95 79.05,22.15 79.05,23.16 J6.5 | 77.22,21.95 74.37,21.95 73.97,22.35 73.97,23.77 J6.1 | 45.52,27.23 45.52,23.77 45.31,23.57 43.89,23.57 U1.P$1 | 45.52,27.23 45.31,27.43 45.31,29.26 U1.15 | 45.52,27.23 47.95,27.23 49.17,28.45 49.58,28.45 50.8,29.67 51.41,29.67 C2.2 | C1.2 37.39,33.73 37.39,32.92 38.2,32.11 38.2,31.29 36.78,29.87 36.78,28.04 37.39,27.43 38,27.43 U1.23 | v38.2,41.25 37.8,41.66 35.36,41.66 34.34,40.64 C11.1 33.73,40.64 32.51,39.42 31.09,39.42 30.48,38.81 | C4.2 C3.1 | 30.48,38.81 30.28,38.61 30.28,34.54 31.7,33.12 RN3.3 | S2.4 72.75,40.23 70.1,37.59 70.1,33.33 68.68,31.9 67.26,31.9 66.65,32.51 64.41,32.51 H1.6 64.21,32.31 64.21,31.7 62.79,30.28 59.54,30.28 56.69,27.43 56.69,26.42 C9.1 56.69,26.21 56.69,25.2 57.91,23.98 57.91,23.16 57.71,22.96 57.71,22.15 C5.2 55.88,20.32 55.88,19.1 54.66,17.88 54.66,16.05
  Top 0.254: 25.2,46.13 25.6,46.13 25.81,46.33 29.06,46.33 29.46,45.92 29.46,39.83 30.48,38.81
  Top 0.406: JP4.1 52.7,15.44 52.7,15.24 52.07,14.61 51.21,14.61 JP3.2
  Route15 0.254: v41.05,19.3 41.05,14.43 43.28,12.19 43.28,10.16 | 43.28,10.16 RN2.4 | 43.28,10.16 RN2.5 | RN3.3 31.9,33.12 32.72,33.12 33.53,33.93 36.58,33.93 36.78,34.14 C1.2
  Bottom 0.254: ON.K 15.85,5.08 15.85,6.1 14.83,7.11 14.83,9.14 15.85,10.16 L.K | 29.87,3.05 U8.4 29.87,3.25 29.87,5.08 30.89,6.1 35.36,6.1 36.17,6.91 U9.2 36.37,7.11 40.03,7.11 43.08,10.16 RN2.5 | 77.22,21.13 78.84,21.13 79.05,20.93 79.05,20.12 J7.5 | 77.22,21.13 74.17,21.13 73.97,20.93 73.97,19.51 J7.1 | 73.97,29.87 73.97,28.45 J8.1 | 73.97,29.87 74.17,30.07 78.84,30.07 79.05,29.87 79.05,29.06 J8.5 79.05,28.85 79.05,27.03 77.22,25.2 v77.22,21.54 77.22,21.13 | S2.4 72.75,40.23 74.57,38.41 74.57,30.89 73.97,30.28 73.97,29.87 | C9.1 56.49,26.42 54.25,28.65 52.63,28.65 C2.2 51.41,29.67 50.39,28.65 47.95,28.65 44.3,32.31 44.3,40.64 C3.1 | 39.83,43.89 42.47,41.25 42.47,40.64 C4.2 | 39.83,43.89 39.22,44.5 39.22,50.8 J1.7 | v38.2,41.25 38.2,42.27 39.83,43.89 | v23.37,31.5 25.2,31.5 26.62,32.92 28.04,32.92 28.25,32.72 31.5,32.72 31.7,32.92 RN3.3
  pour Bottom (isolate 0.001): 12.7,1.27 12.7,52.07 13.97,53.34 77.47,53.34 78.74,52.07 78.74,40.64 81.28,38.1 81.28,5.08 78.74,2.54 78.74,1.27 77.47,0 13.97,0
HWB  (via drill 0.61)
  Top 0.254: v42.27,11.79 42.27,13.21 38.2,17.27 38.2,19.3 U1.33
  Route2 0.254: v42.27,11.79 42.67,12.19 46.13,12.19 48.16,10.16 RN2.3
IO8  (via drill 0.61)
  Top 0.254: v36.37,24.99 35.97,24.59 35.97,23.77 36.17,23.57 38,23.57 U1.28
  Route2 0.254: v36.37,24.99 37.19,24.18 41.45,24.18 43.28,26.01 43.28,28.04 42.88,28.45 42.88,33.93 42.67,34.14 42.67,34.54 48.56,40.44 48.56,44.09 54.25,49.78 54.25,50.8 J1.1
IO9*  (via drill 0.61)
  Top 0.254: J1.2 51.82,51.21 50.6,52.43 33.73,52.43 32.92,51.61 32.92,49.99 v35.15,47.75 | v39.62,19.71 39.62,20.32 39.42,20.52 39.42,21.34 39.83,21.74 39.83,22.35 39.42,22.76 38.2,22.76 U1.29
  Bottom 0.254: v35.15,47.75 35.97,46.94 35.97,37.39 36.17,37.19 36.17,35.36 35.15,34.34 35.15,30.28 38.61,26.82 38.61,26.42 39.01,26.01 39.01,21.54 39.42,21.13 39.42,19.91 v39.62,19.71
IO10*  (via drill 0.61)
  Top 0.254: v34.34,25.2 35.36,24.18 35.36,23.57 36.98,21.95 38,21.95 U1.30
  Route15 0.254: v34.34,25.2 35.76,26.62 35.76,28.85 38.41,31.5 38.41,34.34 39.42,35.36 39.42,38.61 41.05,40.23 41.05,40.64 49.17,48.77 49.17,50.8 J1.3
IO11*  (via drill 0.61)
  Top 0.254: v48.97,30.07 48.36,29.46 47.95,29.46 U1.12
  Bottom 0.254: J1.4 52.63,44.91 52.63,35.36 50.19,32.92 50.19,32.11 48.77,30.68 48.77,30.28 v48.97,30.07
IO12  (via drill 0.61)
  Top 0.254: 48.77,42.88 44.3,47.35 44.3,50.8 J1.5 | 48.77,42.88 51.21,40.44 63.6,40.44 64.21,39.83 65.84,39.83 66.45,39.22 66.45,38.41 68.07,36.78 S2.1 | v41.45,21.95 41.05,22.35 41.05,22.76 38.81,24.99 38.2,24.99 U1.26 | v37.8,43.28 38.2,42.88 48.77,42.88
  Route15 0.254: v37.19,36.37 37.19,42.67 v37.8,43.28
  Bottom 0.254: v41.45,21.95 41.45,24.79 43.28,26.62 43.28,28.04 41.66,29.67 38.61,29.67 38,30.28 38,31.09 38.2,31.29 38.2,33.12 38.81,33.73 38.81,35.36 37.8,36.37 v37.19,36.37
IO13*  (via drill 0.61)
  Top 0.254: v36.37,20.32 38,20.32 U1.32
  Route2 0.254: v49.58,33.73 49.58,32.11 45.31,27.84 45.31,27.23 41.66,23.57 39.62,23.57 v36.37,20.32
  Bottom 0.254: J1.6 41.66,50.39 42.88,49.17 47.55,49.17 52.02,44.7 52.02,35.56 50.6,34.14 49.99,34.14 v49.58,33.73 | 34.92,5.49 35.56,5.49 35.76,5.69 36.78,5.69 37.59,6.5 40.23,6.5 42.27,8.53 43.48,8.53 44.5,9.55 44.5,10.77 44.7,10.97 44.7,11.58 39.01,17.27 39.01,17.68 v36.37,20.32 | 34.92,5.49 31.5,5.49 31.09,5.08 31.09,3.25 U8.3 | JP5.1 arc90 36.2,2.03 36.2,2.54 34.92,3.81 34.92,5.49
LIGHT
  Top 0.254: C13.2 36.78,14.02 35.56,14.02 U7.COLLECTOR
  Route2 0.254: RN3.5 31.7,38 31.7,36.98 30.28,35.56 30.28,20.52 C13.2 38.2,12.8 45.31,12.8 46.33,13.82 47.35,13.82 47.75,13.41 48.56,13.41 50.6,15.44 60.35,15.44 61.77,14.02 62.59,14.02 63.8,15.24 JP6.12
MISO
  Top 0.254: H1.1 61.57,37.39 60.15,35.97 60.15,33.33 59.54,32.72 59.54,31.9 56.29,28.65 52.22,28.65 50.8,27.23 50.6,27.23 50.39,27.43 49.78,27.43 U1.11
MOSI
  Top 0.254: H1.4 64.21,34.75 63.2,34.75 62.18,33.73 61.37,33.73 60.15,32.51 60.15,31.7 56.49,28.04 52.43,28.04 51,26.62 49.78,26.62 U1.10
N$1  (via drill 0.61)
  Top 0.254: v19.71,29.67 19.71,25.4 19.3,24.99 19.3,21.34 17.48,19.51 17.48,14.22 16.05,12.8 TX.A
  Route2 0.254: v19.71,29.67 23.57,33.53 26.62,33.53 27.23,34.14 RN4.3
N$2  (via drill 0.61)
  Top 0.254: v18.69,25.81 18.69,21.54 16.26,19.1 15.65,19.1 14.22,17.68 14.22,8.74 15.24,7.72 15.85,7.72 L.A
  Bottom 0.254: v18.69,25.81 21.34,28.45 26.62,28.45 27.23,29.06 RN4.5
N$3  (via drill 0.61)
  Route2 0.254: v21.13,15.04 21.13,16.87 22.35,18.09 22.35,18.9 27.43,23.98 RN4.7
  Bottom 0.254: v21.13,15.04 21.95,14.22 21.95,8.53 16.05,2.64 ON.A
N$4
  Route15 0.254: RX.A 16.05,17.88 17.68,19.51 17.68,30.48 26.42,39.22 27.23,39.22 RN4.1
N$5  (via drill 0.61)
  Top 0.254: 26.62,6.71 20.93,1.02 14.43,1.02 13.61,1.83 13.61,22.55 14.43,23.37 R7.P$2 | 26.62,6.71 v30.28,10.36 | 26.62,6.71 18.09,15.24 18.09,19.3 19.3,20.52 28.04,20.52 28.85,21.34 28.85,22.35 29.46,22.96 29.46,28.25 31.7,30.48 RN3.2
  Bottom 0.254: v30.28,10.36 31.09,9.55 31.09,8.33 U8.6
N$6  (via drill 0.61)
  Route15 0.254: v22.55,15.04 22.55,17.68 22.35,17.88 22.35,18.69 21.95,19.1 21.95,20.32 25.4,23.77 25.4,25.6 26.42,26.62 27.23,26.62 RN4.6
  Bottom 0.254: 33.73,3.45 33.53,3.25 U8.1 33.66,1.91 | JP5.2 33.66,1.91 | U8.2 32.38,1.91 | 32.38,1.91 33.66,1.91 | v22.55,15.04 22.55,10.16 29.06,3.66 29.06,1.22 29.26,1.02 32.11,1.02 32.31,1.22 32.31,1.83 32.38,1.91
N$9  (via drill 0.61)
  Route2 0.254: v66.45,12.8 63.8,10.16 C10.1
  Bottom 0.254: v66.45,12.8 66.45,29.06 67.87,30.48 RN1.2 | U9.1 36.37,4.47 37.8,5.89 42.47,5.89 44.5,7.92 54.86,7.92 55.47,8.53 58.73,8.53 59.54,9.35 59.54,10.16 C10.1
N$11  (via drill 0.61)
  Top 0.254: v42.27,7.11 42.27,8.13 40.64,9.75 RN2.6
  Bottom 0.254: RN2.6 37.59,10.16 34.14,6.71 30.68,6.71 30.07,6.1 29.87,6.3 29.87,8.33 U8.5 | C10.2 56.29,10.16 54.66,8.53 44.3,8.53 43.69,7.92 43.08,7.92 v42.27,7.11
N$16
  Top 0.254: RN3.1 31.9,28.04 34.14,28.04 D1.A
  Bottom 0.254: U8.7 32.31,8.33 32.31,14.43 35.36,17.48 35.36,26.82 34.34,27.84 D1.A
RA
  Top 0.254: J5.4 73.97,19.51 73.97,21.54 73.56,21.95 72.14,21.95 69.49,24.59 69.49,26.82 68.48,27.84 68.07,27.84 RN1.3 67.87,28.04 64.82,28.04 JP6.2
RB  (via drill 0.61)
  Top 0.254: v70.1,27.64 73.97,27.64 73.97,28.25 J6.4 | RN1.4 JP6.4
  Bottom 0.254: v70.1,27.64 67.87,25.4 RN1.4
RC
  Top 0.254: JP6.6 64.82,22.96 67.87,22.96 RN1.5
  Bottom 0.254: J7.4 73.97,15.04 73.97,15.44 69.7,15.44 69.49,15.65 69.49,21.34 68.07,22.76 RN1.5
RD  (via drill 0.61)
  Top 0.254: v71.32,21.34 69.09,21.34 68.07,20.32 RN1.6 JP6.8
  Bottom 0.254: v71.32,21.34 73.56,21.34 73.97,21.74 73.97,23.77 J8.4
RD+  (via drill 0.61)
  Top 0.254: v40.64,25.4 43.48,22.55 44.3,22.55 44.7,22.96 46.94,22.96 47.55,22.35 47.95,22.35 48.36,21.95 49.58,21.95 U1.4
  Route2 0.254: v32.72,26.42 38.61,26.42 39.62,25.4 v40.64,25.4
  Bottom 0.254: v32.72,26.42 30.48,26.42 30.28,26.62 30.28,29.06 28.65,30.68 26.01,30.68 24.38,29.06 22.35,29.06 21.74,29.67 R9.P$2
RD-  (via drill 0.61)
  Top 0.254: v46.74,21.74 47.75,21.74 48.36,21.13 49.58,21.13 U1.3
  Route15 0.254: v32.51,22.96 32.92,23.37 36.98,23.37 37.8,24.18 44.3,24.18 v46.74,21.74
  Bottom 0.254: v32.51,22.96 29.87,25.6 26.42,25.6 25.4,26.62 21.74,26.62 R8.P$2
RESET  (via drill 0.61)
  Top 0.254: J3.3 45.72,2.85 46.94,4.06 48.16,4.06 53.24,9.14 53.24,10.16 RN2.1 | v52.63,31.09 50.8,31.09 50.19,30.48 50.19,29.87 49.38,29.06 48.97,29.06 47.95,28.04 47.55,28.04 46.94,28.65 46.94,29.26 U1.13
  Route2 0.254: v47.95,23.37 50.39,23.37 50.8,22.96 52.02,22.96 54.05,24.99 55.27,24.99 55.47,24.79 58.32,24.79 D2.A
  Bottom 0.254: D2.A 59.54,26.01 59.54,28.04 | 59.54,28.04 59.54,29.06 61.77,31.29 61.77,32.31 H1.5 | 53.03,30.68 55.68,28.04 59.54,28.04 | 53.03,30.68 v52.63,31.09 | 53.03,30.68 55.88,33.53 55.88,52.22 55.68,52.43 30.48,52.43 30.28,52.22 30.28,49.78 28.85,48.36 27.43,48.36 27.23,48.56 20.12,48.56 17.68,51 14.63,51 S1.1 | v47.95,23.37 47.95,19.1 53.24,13.82 53.24,10.16 RN2.1
RXLED  (via drill 0.61)
  Top 0.254: v47.95,25.81 47.95,25.2 48.16,24.99 49.58,24.99 U1.8
  Route2 0.254: v33.93,13.82 v26.82,13.82
  Route15 0.254: v33.93,13.82 35.15,13.82 38.2,16.87 38.2,18.69 38,18.9 38,20.73 40.84,23.57 44.09,23.57 45.72,21.95 45.72,21.34 46.33,20.73 51.41,20.73 52.63,19.51 54.05,19.51 55.07,20.52 55.07,21.34 54.05,22.35 53.65,22.35 53.03,22.96 50.8,22.96 v47.95,25.81
  Bottom 0.254: v26.82,13.82 26.82,14.43 25.2,16.05 19.1,16.05 16.46,18.69 16.46,19.91 16.05,20.32 RX.K
SCK  (via drill 0.61)
  Top 0.254: v52.02,25.4 51.61,25.81 49.78,25.81 U1.9
  Route15 0.254: v52.02,25.4 51.82,25.6 51.82,27.03 59.54,34.75 61.57,34.75 H1.3
SLIDER
  Route15 0.254: JP6.14 64.62,12.6 60.76,8.74 58.93,8.74 55.47,5.28 54.46,5.28 52.02,2.85 52.02,2.23 50.8,1.02 31.9,1.02 31.5,1.42 31.5,10.57 23.57,18.49 U10.P$2
SOUND  (via drill 0.61)
  Top 0.254: RN3.4 D1.C 34.34,35.56 34.34,38 | v52.63,33.93 52.43,34.14 51.41,34.14 48.97,31.7 46.94,31.7 43.08,35.56 v43.08,36.37 | 34.34,38 v38.41,38 | 34.34,38 C11.2
  Route2 0.254: v52.63,33.93 58.12,28.45 59.94,28.45 60.76,27.64 60.96,27.64 61.77,26.82 62.38,26.82 63.4,25.81 63.4,25.2 63.8,24.79 63.8,23.57 63.6,23.37 63.6,22.35 63.8,22.15 63.8,20.93 63.6,20.73 63.6,19.91 64.62,18.9 64.62,17.88 JP6.10
  Bottom 0.254: v43.08,36.37 43.08,35.36 42.88,35.15 40.64,35.15 38.41,37.39 v38.41,38
TXLED  (via drill 0.61)
  Top 0.254: v38.61,28.65 39.01,28.65 39.62,29.26 U1.22
  Route15 0.254: v38.61,28.65 38.61,26.42 37.59,25.4 37.59,24.79 36.78,23.98 31.5,23.98 27.64,27.84 26.82,27.84 24.79,25.81 24.79,23.98 16.05,15.24 TX.K
UCAP
  Top 0.254: C7.1 53.85,23.57 49.78,23.57 U1.6
UGND  (via drill 0.61)
  Top 0.254: U1.5 52.87,22.7 53.34,22.23 55.24,22.23 55.24,19.43 | v23.98,34.54 23.98,33.12 24.59,33.12 L2.1 | 8.33,32.66 6.91,32.51 5.08,32.51 X1.GND | v64.62,40.84 64.01,40.84 63.8,41.05 51.41,41.05 49.58,42.88 v49.58,43.48 | v46.33,43.89 45.92,43.48 39.01,43.48 38.2,44.3 v32.51,44.3
  Top 0.406: C7.2 55.24,22.23 | JP4.2 55.24,19.43
  Top 1.016: 8.33,32.66 10.67,32.66 v11.33,33.33
  Bottom 0.254: 21.74,36.78 21.34,37.19 21.34,37.39 21.13,37.59 X2.GND | 21.74,36.78 22.76,35.76 | 22.76,35.76 v23.98,34.54 | 21.74,36.78 18.29,33.33 v11.33,33.33 | v64.62,40.84 65.84,39.62 65.84,32.31 64.21,30.68 61.98,30.68 60.15,28.85 60.15,26.21 60.35,26.01 60.35,24.79 59.13,23.57 56.69,23.57 C7.2 | v49.58,43.48 46.74,43.48 v46.33,43.89 | v32.51,44.3 29.46,41.25 26.42,41.25 24.79,39.62 24.79,37.8 22.76,35.76
XTAL1
  Top 0.254: Y1.2 41.25,36.78 40.03,35.56 40.03,33.12 R1.P$1 40.03,32.92 41.86,32.92 43.89,30.89 43.89,29.46 U1.17
  Bottom 0.254: C4.1 40.03,40.64 40.03,38.2 41.25,36.98 Y1.2
XTAL2  (via drill 0.61)
  Top 0.254: C3.2 46.94,40.64 46.53,40.23 46.53,36.98 Y1.1 46.53,36.78 46.53,34.14 47.55,33.12 R1.P$2 | v44.3,27.64 44.5,27.64 44.7,27.84 44.7,29.26 U1.16
  Route2 0.254: v44.3,27.64 44.3,29.67 47.55,32.92 R1.P$2
XUSB
  Top 0.254: 23.37,41.86 23.37,43.69 F1.2 | 21.13,41.05 X2.VBUS 20.93,41.05 | 7.11,25.6 6.91,25.4 5.08,25.4 X1.5V
  Top 0.305: 14.83,38 13.82,38 13.61,37.8 13.61,32.28
  Top 0.813: 21.13,41.05 22.55,41.05 23.37,41.86 | 20.93,41.05 20.32,41.66 18.49,41.66 14.83,38 | 13.61,32.28 11.81,30.48 11.81,27.23 10.19,25.6
  Top 1.016: 7.11,25.6 10.19,25.6
(copper drawn outside any net)
  shapes: Bottom area x1

### Text on the board
Top: CSA
Bottom: v4
tPlace: 13 | 12 | 11 | 10 | 9 | 8 | 7 | 6 | 5 | 4 | 3 | 2 | 1 | 0 | # | # | # | # | GND | # | # | # | AREF | DIGITAL | [#=PWM] | TX1 | RX1 | 2012-06-08 v4 | - | XOrduino! | ANALOG IN | IOREF | RST | 3V3 | 5V | GND | GND | VIN | A0 | A1 | A2 | A3 | A4 | A5
tNames: PWM COMPL1 | PWM COMPL2 | SCL | SDA | A11 | A10 | A9 | A8 | (AIN0) | A7 | A6 | M.Banzi | D.Cuartielles | T.Igoe | G.Martino | D.Mellis | C. Scott Ananian | 1